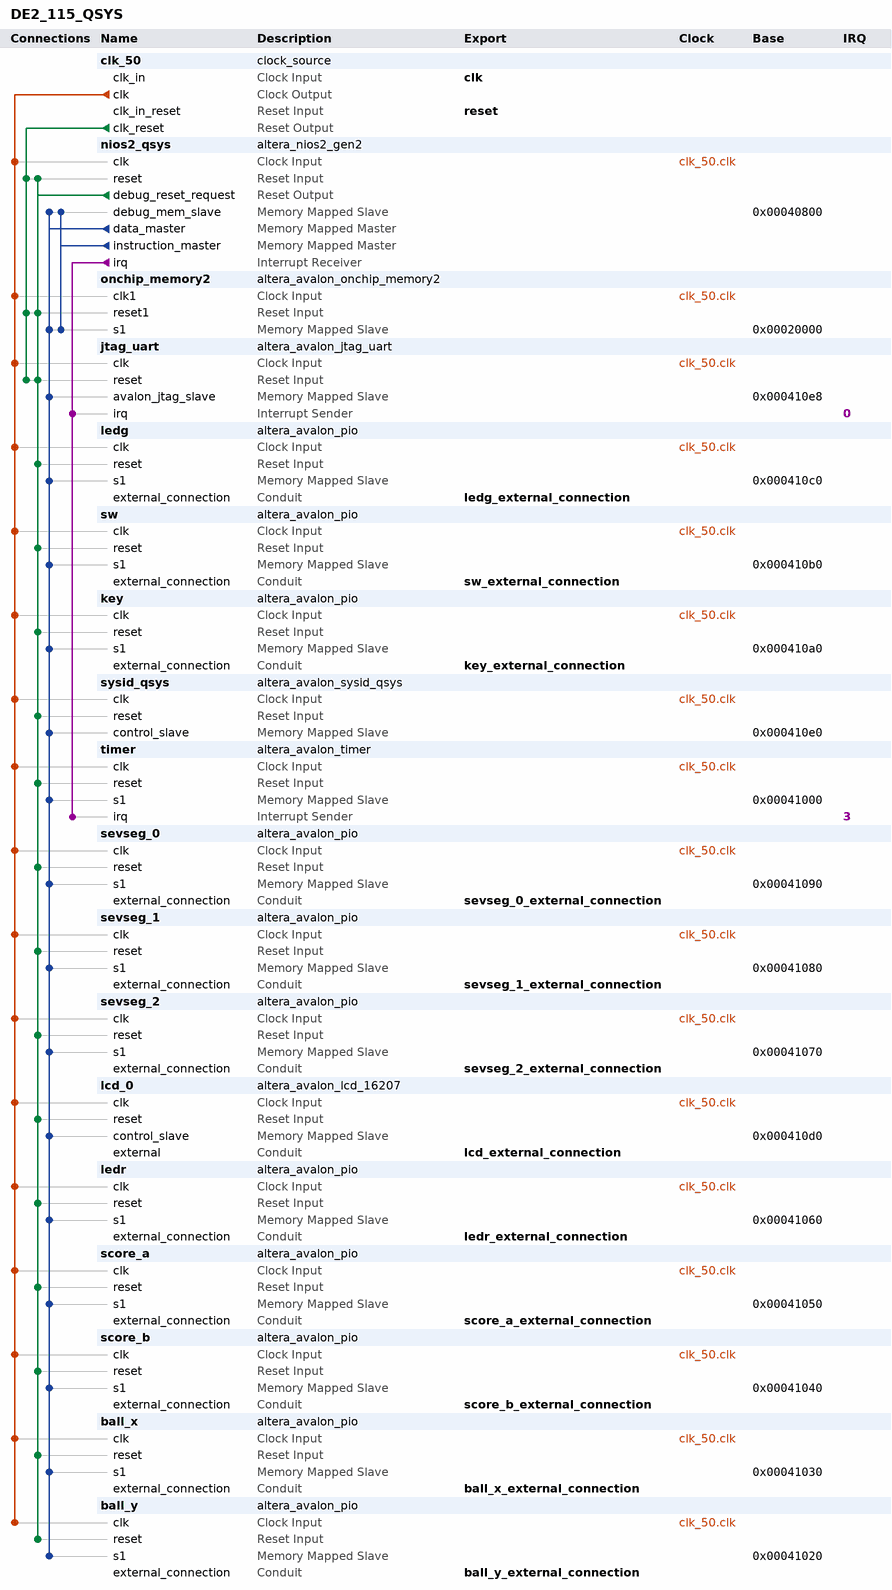
[diagram p0: system contents]
# Platform Designer (Qsys) system DE2_115_QSYS, Cyclone IV E EP4CE115F29C7
# Parameters at their usual value, and those the tool derives, are not listed.
package require -exact qsys 17.0
create_system DE2_115_QSYS
set_project_property DEVICE_FAMILY {Cyclone IV E}
set_project_property DEVICE EP4CE115F29C7

add_instance clk_50 clock_source 17.0
set_instance_parameter_value clk_50 clockFrequency 50000000

add_instance nios2_qsys altera_nios2_gen2 17.0
set_instance_parameter_value nios2_qsys dcache_size 2048
set_instance_parameter_value nios2_qsys exceptionSlave onchip_memory2.s1
set_instance_parameter_value nios2_qsys icache_size 4096
set_instance_parameter_value nios2_qsys impl Tiny
set_instance_parameter_value nios2_qsys resetSlave onchip_memory2.s1

add_instance onchip_memory2 altera_avalon_onchip_memory2 17.0
set_instance_parameter_value onchip_memory2 dataWidth 32
set_instance_parameter_value onchip_memory2 dualPort false
set_instance_parameter_value onchip_memory2 initMemContent true
set_instance_parameter_value onchip_memory2 initializationFileName onchip_mem.hex
set_instance_parameter_value onchip_memory2 memorySize 100000

add_instance jtag_uart altera_avalon_jtag_uart 17.0
set_instance_parameter_value jtag_uart simInteractiveOptions NO_INTERACTIVE_WINDOWS

add_instance ledg altera_avalon_pio 17.0
set_instance_parameter_value ledg direction Output
set_instance_parameter_value ledg width 9

add_instance sw altera_avalon_pio 17.0
set_instance_parameter_value sw direction Input
set_instance_parameter_value sw width 10

add_instance key altera_avalon_pio 17.0
set_instance_parameter_value key direction Input
set_instance_parameter_value key width 4

add_instance sysid_qsys altera_avalon_sysid_qsys 17.0
set_instance_parameter_value sysid_qsys id 0

add_instance timer altera_avalon_timer 17.0
set_instance_parameter_value timer period 1
set_instance_parameter_value timer periodUnits MSEC

add_instance sevseg_0 altera_avalon_pio 17.0
set_instance_parameter_value sevseg_0 direction Output
set_instance_parameter_value sevseg_0 width 8

add_instance sevseg_1 altera_avalon_pio 17.0
set_instance_parameter_value sevseg_1 direction Output
set_instance_parameter_value sevseg_1 width 8

add_instance sevseg_2 altera_avalon_pio 17.0
set_instance_parameter_value sevseg_2 direction Output
set_instance_parameter_value sevseg_2 width 16

add_instance lcd_0 altera_avalon_lcd_16207 17.0

add_instance ledr altera_avalon_pio 17.0
set_instance_parameter_value ledr direction Output
set_instance_parameter_value ledr width 18

add_instance score_a altera_avalon_pio 17.0
set_instance_parameter_value score_a direction Output
set_instance_parameter_value score_a width 7

add_instance score_b altera_avalon_pio 17.0
set_instance_parameter_value score_b direction Output
set_instance_parameter_value score_b width 7

add_instance ball_x altera_avalon_pio 17.0
set_instance_parameter_value ball_x direction Input
set_instance_parameter_value ball_x width 6

add_instance ball_y altera_avalon_pio 17.0
set_instance_parameter_value ball_y direction Input
set_instance_parameter_value ball_y width 6

# connections
add_connection clk_50.clk ball_x.clk clock
add_connection clk_50.clk ball_y.clk clock
add_connection clk_50.clk jtag_uart.clk clock
add_connection clk_50.clk key.clk clock
add_connection clk_50.clk lcd_0.clk clock
add_connection clk_50.clk ledg.clk clock
add_connection clk_50.clk ledr.clk clock
add_connection clk_50.clk nios2_qsys.clk clock
add_connection clk_50.clk onchip_memory2.clk1 clock
add_connection clk_50.clk score_a.clk clock
add_connection clk_50.clk score_b.clk clock
add_connection clk_50.clk sevseg_0.clk clock
add_connection clk_50.clk sevseg_1.clk clock
add_connection clk_50.clk sevseg_2.clk clock
add_connection clk_50.clk sw.clk clock
add_connection clk_50.clk sysid_qsys.clk clock
add_connection clk_50.clk timer.clk clock
add_connection clk_50.clk_reset jtag_uart.reset reset
add_connection clk_50.clk_reset nios2_qsys.reset reset
add_connection clk_50.clk_reset onchip_memory2.reset1 reset
add_connection nios2_qsys.debug_reset_request ball_x.reset reset
add_connection nios2_qsys.debug_reset_request ball_y.reset reset
add_connection nios2_qsys.debug_reset_request jtag_uart.reset reset
add_connection nios2_qsys.debug_reset_request key.reset reset
add_connection nios2_qsys.debug_reset_request lcd_0.reset reset
add_connection nios2_qsys.debug_reset_request ledg.reset reset
add_connection nios2_qsys.debug_reset_request ledr.reset reset
add_connection nios2_qsys.debug_reset_request nios2_qsys.reset reset
add_connection nios2_qsys.debug_reset_request onchip_memory2.reset1 reset
add_connection nios2_qsys.debug_reset_request score_a.reset reset
add_connection nios2_qsys.debug_reset_request score_b.reset reset
add_connection nios2_qsys.debug_reset_request sevseg_0.reset reset
add_connection nios2_qsys.debug_reset_request sevseg_1.reset reset
add_connection nios2_qsys.debug_reset_request sevseg_2.reset reset
add_connection nios2_qsys.debug_reset_request sw.reset reset
add_connection nios2_qsys.debug_reset_request sysid_qsys.reset reset
add_connection nios2_qsys.debug_reset_request timer.reset reset
add_connection nios2_qsys.data_master ball_x.s1 avalon
set_connection_parameter_value nios2_qsys.data_master/ball_x.s1 baseAddress 0x00041030
add_connection nios2_qsys.data_master ball_y.s1 avalon
set_connection_parameter_value nios2_qsys.data_master/ball_y.s1 baseAddress 0x00041020
add_connection nios2_qsys.data_master jtag_uart.avalon_jtag_slave avalon
set_connection_parameter_value nios2_qsys.data_master/jtag_uart.avalon_jtag_slave baseAddress 0x000410e8
add_connection nios2_qsys.data_master key.s1 avalon
set_connection_parameter_value nios2_qsys.data_master/key.s1 baseAddress 0x000410a0
add_connection nios2_qsys.data_master lcd_0.control_slave avalon
set_connection_parameter_value nios2_qsys.data_master/lcd_0.control_slave baseAddress 0x000410d0
add_connection nios2_qsys.data_master ledg.s1 avalon
set_connection_parameter_value nios2_qsys.data_master/ledg.s1 baseAddress 0x000410c0
add_connection nios2_qsys.data_master ledr.s1 avalon
set_connection_parameter_value nios2_qsys.data_master/ledr.s1 baseAddress 0x00041060
add_connection nios2_qsys.data_master nios2_qsys.debug_mem_slave avalon
set_connection_parameter_value nios2_qsys.data_master/nios2_qsys.debug_mem_slave baseAddress 0x00040800
add_connection nios2_qsys.data_master onchip_memory2.s1 avalon
set_connection_parameter_value nios2_qsys.data_master/onchip_memory2.s1 baseAddress 0x00020000
add_connection nios2_qsys.data_master score_a.s1 avalon
set_connection_parameter_value nios2_qsys.data_master/score_a.s1 baseAddress 0x00041050
add_connection nios2_qsys.data_master score_b.s1 avalon
set_connection_parameter_value nios2_qsys.data_master/score_b.s1 baseAddress 0x00041040
add_connection nios2_qsys.data_master sevseg_0.s1 avalon
set_connection_parameter_value nios2_qsys.data_master/sevseg_0.s1 baseAddress 0x00041090
add_connection nios2_qsys.data_master sevseg_1.s1 avalon
set_connection_parameter_value nios2_qsys.data_master/sevseg_1.s1 baseAddress 0x00041080
add_connection nios2_qsys.data_master sevseg_2.s1 avalon
set_connection_parameter_value nios2_qsys.data_master/sevseg_2.s1 baseAddress 0x00041070
add_connection nios2_qsys.data_master sw.s1 avalon
set_connection_parameter_value nios2_qsys.data_master/sw.s1 baseAddress 0x000410b0
add_connection nios2_qsys.data_master sysid_qsys.control_slave avalon
set_connection_parameter_value nios2_qsys.data_master/sysid_qsys.control_slave baseAddress 0x000410e0
add_connection nios2_qsys.data_master timer.s1 avalon
set_connection_parameter_value nios2_qsys.data_master/timer.s1 baseAddress 0x00041000
add_connection nios2_qsys.instruction_master nios2_qsys.debug_mem_slave avalon
set_connection_parameter_value nios2_qsys.instruction_master/nios2_qsys.debug_mem_slave baseAddress 0x00040800
add_connection nios2_qsys.instruction_master onchip_memory2.s1 avalon
set_connection_parameter_value nios2_qsys.instruction_master/onchip_memory2.s1 baseAddress 0x00020000
add_connection nios2_qsys.irq jtag_uart.irq interrupt
set_connection_parameter_value nios2_qsys.irq/jtag_uart.irq irqNumber 0
add_connection nios2_qsys.irq timer.irq interrupt
set_connection_parameter_value nios2_qsys.irq/timer.irq irqNumber 3

# exported interfaces
add_interface ball_x_external_connection conduit end
set_interface_property ball_x_external_connection EXPORT_OF ball_x.external_connection
add_interface ball_y_external_connection conduit end
set_interface_property ball_y_external_connection EXPORT_OF ball_y.external_connection
add_interface clk clock sink
set_interface_property clk EXPORT_OF clk_50.clk_in
add_interface key_external_connection conduit end
set_interface_property key_external_connection EXPORT_OF key.external_connection
add_interface lcd_external_connection conduit end
set_interface_property lcd_external_connection EXPORT_OF lcd_0.external
add_interface ledg_external_connection conduit end
set_interface_property ledg_external_connection EXPORT_OF ledg.external_connection
add_interface ledr_external_connection conduit end
set_interface_property ledr_external_connection EXPORT_OF ledr.external_connection
add_interface reset reset sink
set_interface_property reset EXPORT_OF clk_50.clk_in_reset
add_interface score_a_external_connection conduit end
set_interface_property score_a_external_connection EXPORT_OF score_a.external_connection
add_interface score_b_external_connection conduit end
set_interface_property score_b_external_connection EXPORT_OF score_b.external_connection
add_interface sevseg_0_external_connection conduit end
set_interface_property sevseg_0_external_connection EXPORT_OF sevseg_0.external_connection
add_interface sevseg_1_external_connection conduit end
set_interface_property sevseg_1_external_connection EXPORT_OF sevseg_1.external_connection
add_interface sevseg_2_external_connection conduit end
set_interface_property sevseg_2_external_connection EXPORT_OF sevseg_2.external_connection
add_interface sw_external_connection conduit end
set_interface_property sw_external_connection EXPORT_OF sw.external_connection

set_interconnect_requirement {$system} qsys_mm.clockCrossingAdapter HANDSHAKE
set_interconnect_requirement {$system} qsys_mm.enableEccProtection FALSE
set_interconnect_requirement {$system} qsys_mm.insertDefaultSlave FALSE
set_interconnect_requirement {$system} qsys_mm.maxAdditionalLatency 1

save_system DE2_115_QSYS.qsys
